# EAGLE design capelet_solar (EAGLE 9.5.2)
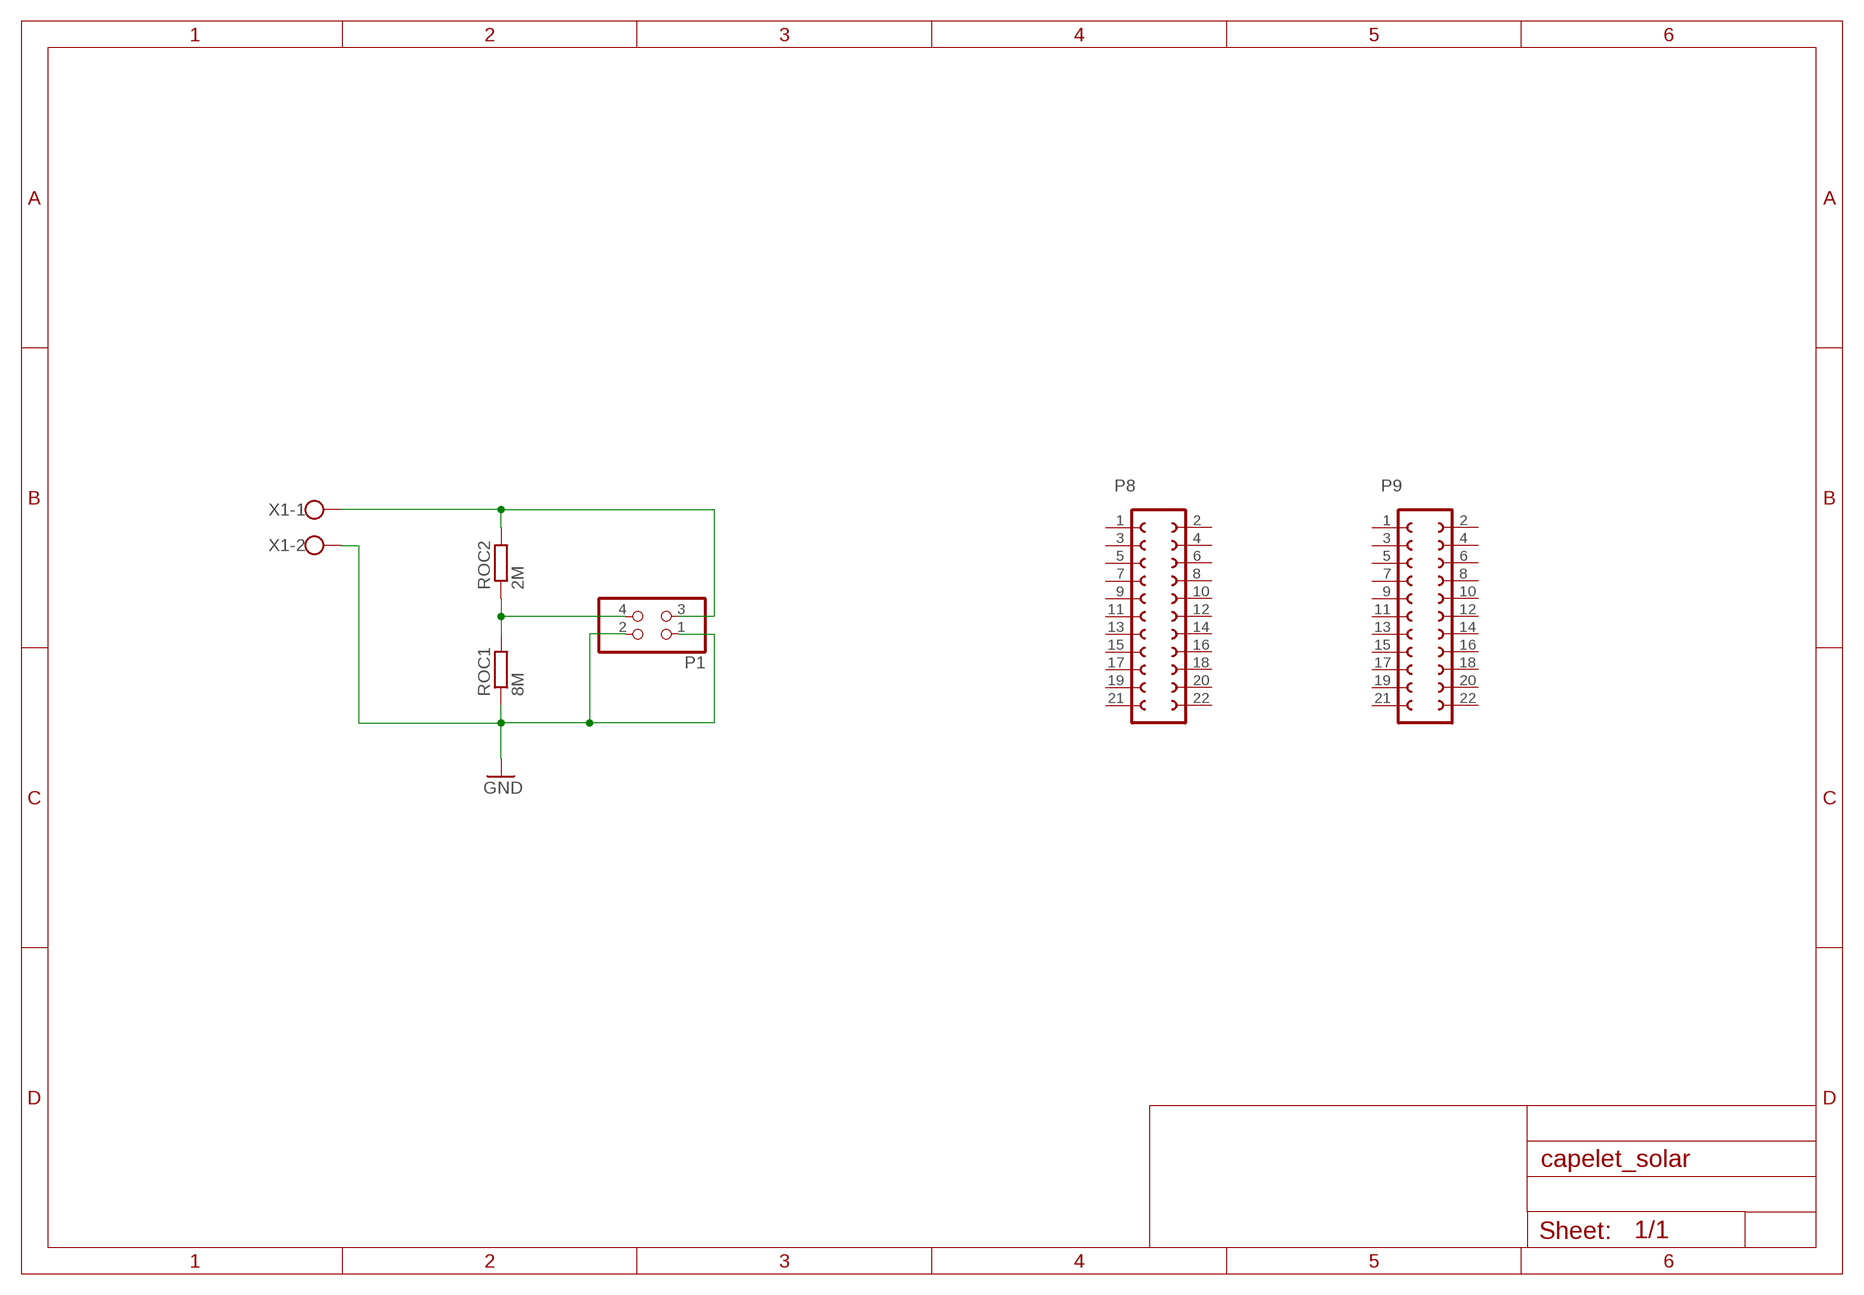
[diagram p0: schematic, sheet 1]

## Parts
P1  PINHD-2X2  [2X02]
P8  FE11-2  [FE11-2]
P9  FE11-2  [FE11-2]
ROC1  8M  R_SMD0805  [RESC2012X65]
ROC2  2M  R_SMD0805  [RESC2012X65]
X1  W237-102  [W237-102]

## Nets
GND: P1.1 P1.2 ROC1.1 X1.2
N$2: P1.3 ROC2.2 X1.1
N$5: P1.4 ROC1.2 ROC2.1
Unconnected: P8.1 P8.2 P8.3 P8.4 P8.5 P8.6 P8.7 P8.8 P8.9 P8.10 P8.11 P8.12 P8.13 P8.14 P8.15 P8.16 P8.17 P8.18 P8.19 P8.20 P8.21 P8.22 P9.1 P9.2 P9.3 P9.4 P9.5 P9.6 P9.7 P9.8 P9.9 P9.10 P9.11 P9.12 P9.13 P9.14 P9.15 P9.16 P9.17 P9.18 P9.19 P9.20 P9.21 P9.22

## Library data of the parts
P1 = pinhead:PINHD-2X2: PIN HEADER
P8 P9 = shepherd:FE11-2
ROC1 ROC2 = mylib:R_SMD
X1 = con-wago-500:W237-102: WAGO SCREW CLAMP; MPN: 237-102; OC_FARNELL: unknown; OC_NEWARK: 70K9898

## Board
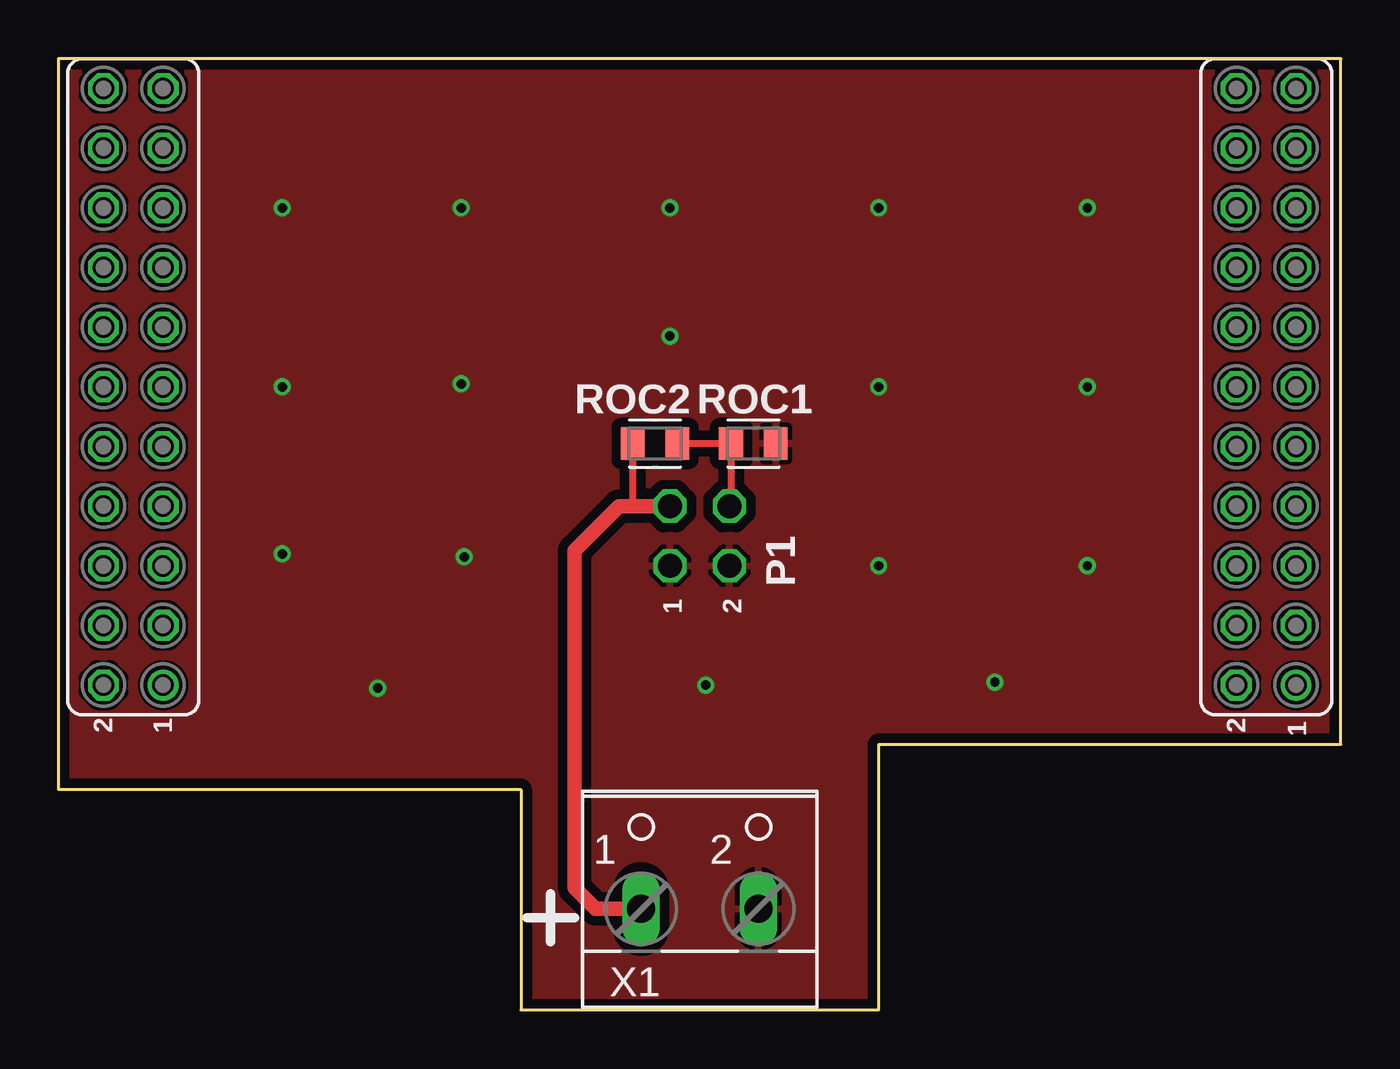
[diagram p1: board, top side]
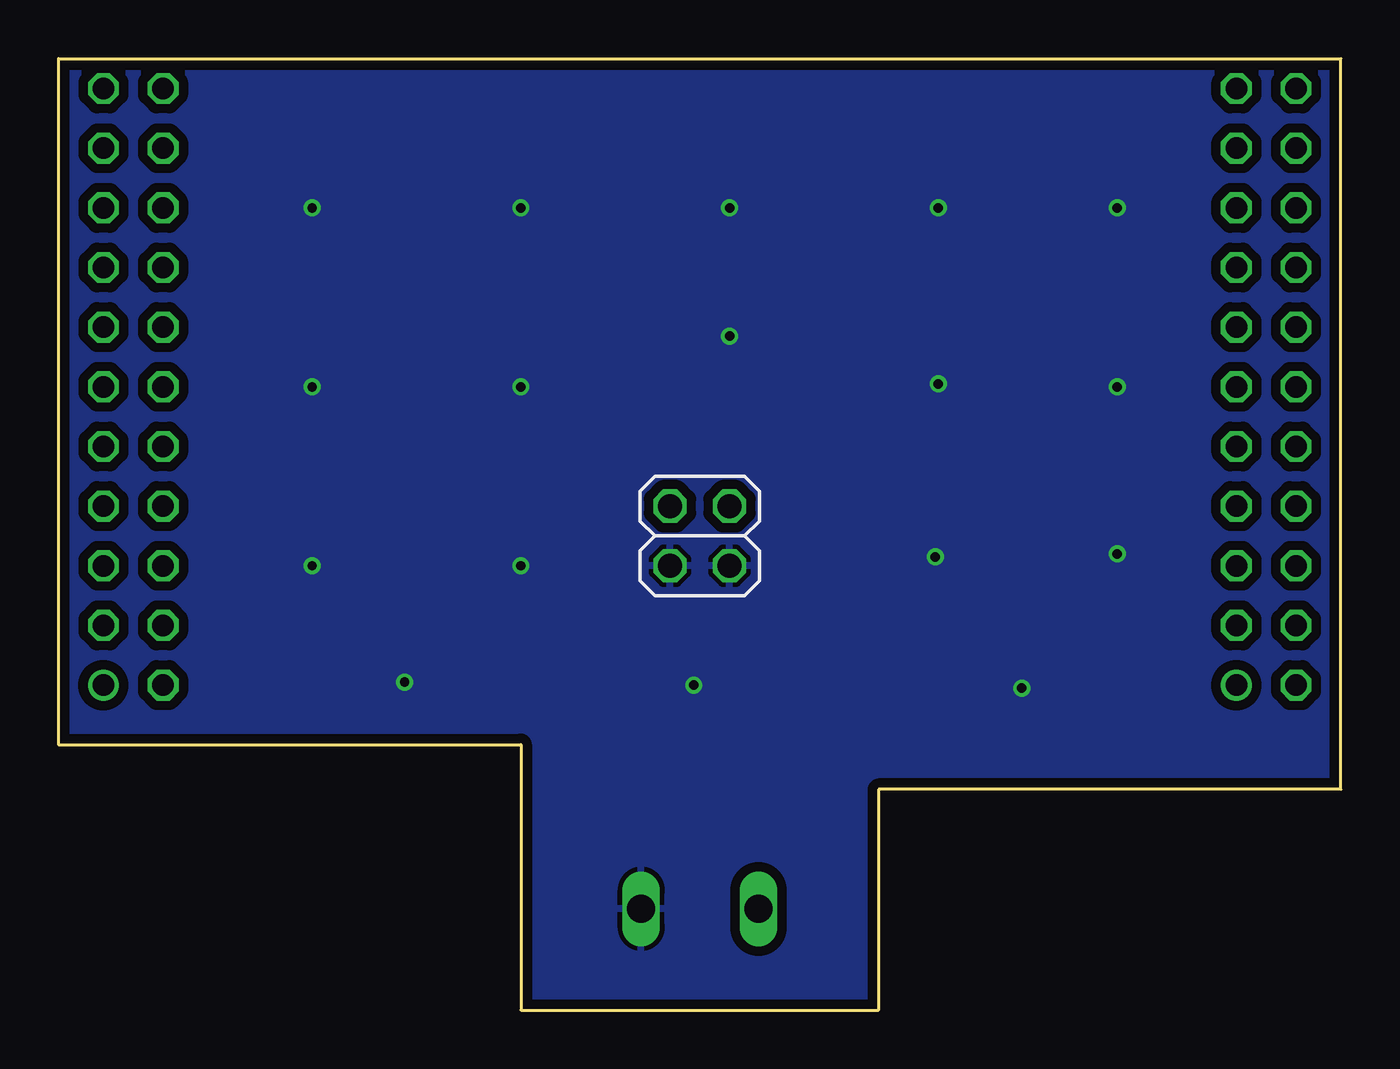
[diagram p2: board, bottom side, seen from below]

Size 54.61 x 40.51 mm. Coordinates in mm from the lower left corner, seen from the top.
Copper layers (1*16): Top 0.035mm / dielectric 1.5mm / Bottom 0.035mm
Design rules "PCB-POOL Standard *": minimum track width 0.15mm, minimum drill 0.3mm, track to track 0.15mm, track to pad 0.15mm, pad to pad 0.15mm, via to via 0.15mm, smd to smd 0.15mm, copper to edge 0.3mm, drill to drill 0.2mm, minimum pad ring 0.2mm, minimum via ring 0.15mm, stop-mask expansion 0.03mm, vias tented up to drill 30mil, thermal gap 0.2mm

### Footprints (pad centres in the part's own frame; a part is rotated, then mirrored left to right if it is on the bottom)
2X02 = drill 1.016 octagon: 1 -1.27,-1.27; 2 -1.27,1.27; 3 1.27,-1.27; 4 1.27,1.27
FE11-2 = drill 0.914: 1 12.7,1.27 | drill 0.914 octagon: 2 12.7,-1.27; 3 10.16,1.27; 4 10.16,-1.27; 5 7.62,1.27; 6 7.62,-1.27; 7 5.08,1.27; 8 5.08,-1.27; 9 2.54,1.27; 10 2.54,-1.27; 11 0,1.27; 12 0,-1.27; 13 -2.54,1.27; 14 -2.54,-1.27; 15 -5.08,1.27; 16 -5.08,-1.27; 17 -7.62,1.27; 18 -7.62,-1.27; 19 -10.16,1.27; 20 -10.16,-1.27; 21 -12.7,1.27; 22 -12.7,-1.27
RESC2012X65 = smd 1.015 x 1.379: 1 -0.95,0; 2 0.95,0
W237-102 = drill 1.194 long: 1 -2.5,-1.27; 2 2.5,-1.27

### Placement (x,y rotation side)
P1  27.3,20.19 90 bottom
P8  3.17,26.54 270 top
P9  51.44,26.54 270 top
ROC1  29.59,24.13 180 top
ROC2  25.4,24.13 180 top
U$1  [SHPRD_CPLT_H]  0,0 0 top
X1  27.3,5.59 0 top

### Tracks (layer width: path | path; a pad name or v marks a point on that pad's centre or on a via)
GND  (via drill 0.4)
  other vias: 9.53,34.16 9.53,26.54 17.14,34.16 26.04,34.16 34.92,34.16 43.81,34.16 26.04,28.7 34.92,26.54 43.81,26.54 34.92,18.92 43.81,18.92 17.14,26.67 17.27,19.3 13.59,13.72 39.88,13.97 9.53,19.43 27.56,13.84
  pour Top (isolate 0.406): 0,40.51 54.61,40.51 54.61,0 0,0
  pour Bottom (isolate 0.406): 0,40.51 54.61,40.51 54.61,0 0,0
N$2
  Top 0.305: ROC2.2 24.45,21.52 24.51,21.46
  Top 0.61: X1.1 22.86,4.32 21.97,5.21 21.97,19.56 23.88,21.46 24.51,21.46 P1.3
N$5
  Top 0.305: ROC2.1 ROC1.2 28.64,21.53 P1.4

### Text on the board
tPlace: 1 | 2 | 2 | 1 | 2 | 1
tStop: SHEPHERD v1.5 CAPELET SOLAR
Document: P1: Pins pointing to bottom, / solder on top